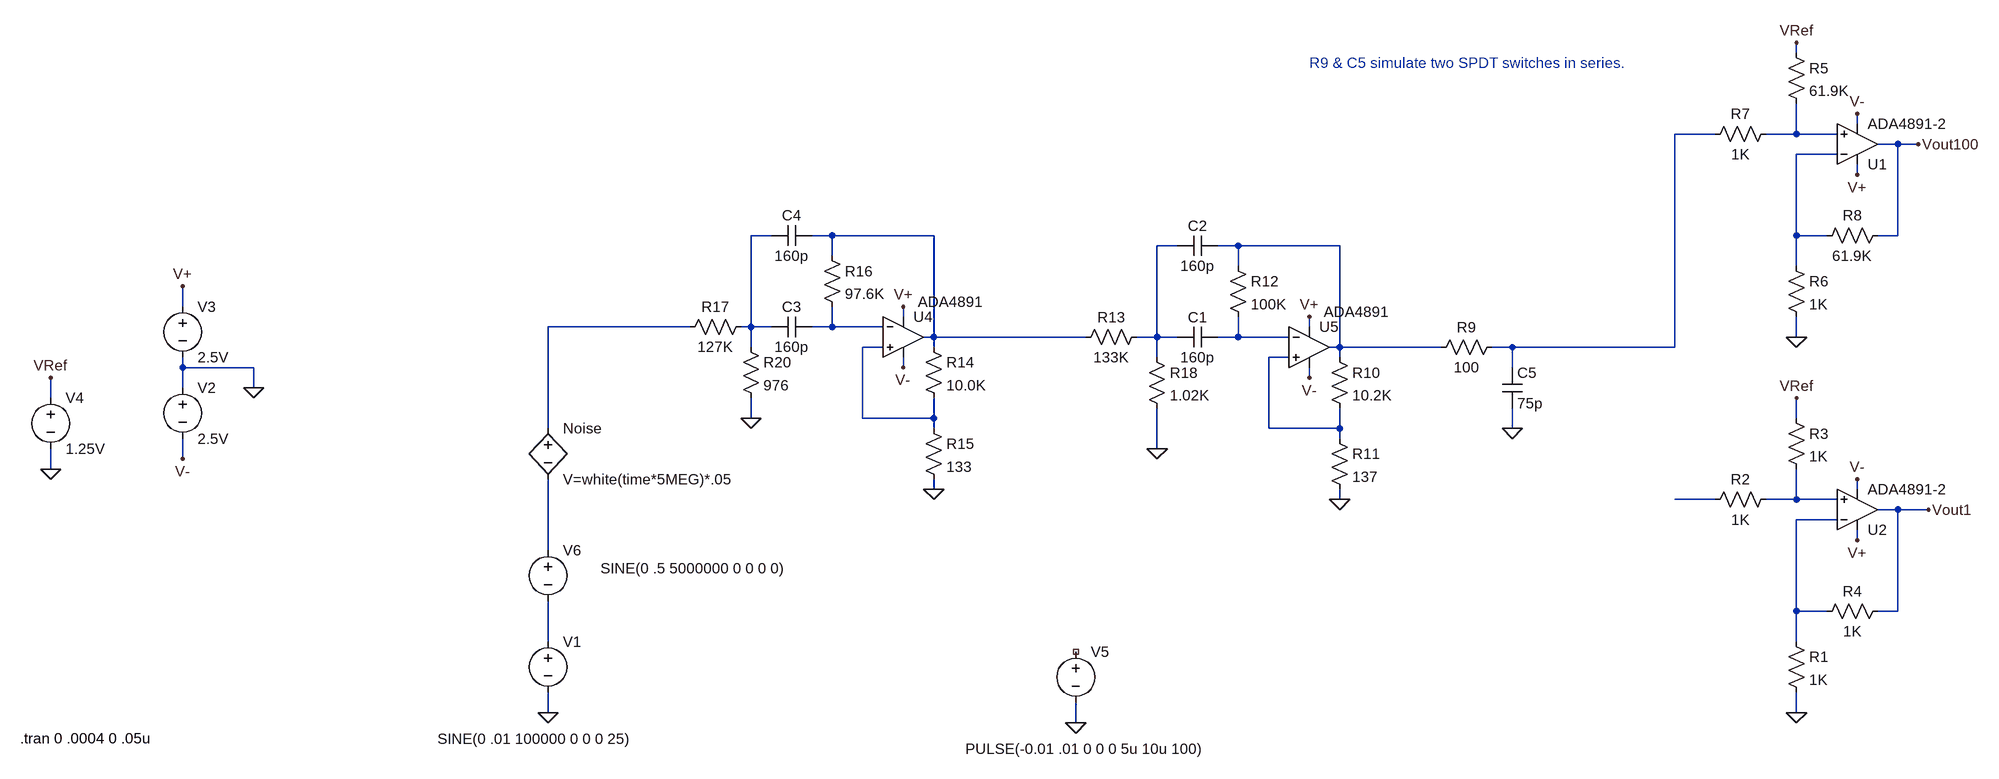
[diagram p0: schematic Draft1.asc]
Draft1.asc, the LTspice schematic file:
Version 4
SHEET 1 1764 792
WIRE 1456 -320 1456 -336
WIRE 1552 -208 1552 -224
WIRE 1328 -192 1264 -192
WIRE 1456 -192 1456 -240
WIRE 1456 -192 1408 -192
WIRE 1520 -192 1456 -192
WIRE 1616 -176 1584 -176
WIRE 1648 -176 1616 -176
WIRE 1520 -160 1456 -160
WIRE 1552 -128 1552 -144
WIRE -160 -32 -192 -32
WIRE -64 -32 -96 -32
WIRE 96 -32 -64 -32
WIRE 1456 -32 1456 -160
WIRE 1504 -32 1456 -32
WIRE 1616 -32 1616 -176
WIRE 1616 -32 1584 -32
WIRE 480 -16 448 -16
WIRE 576 -16 544 -16
WIRE 736 -16 576 -16
WIRE -64 0 -64 -32
WIRE 576 16 576 -16
WIRE 1456 16 1456 -32
WIRE -1088 80 -1088 48
WIRE 48 96 48 80
WIRE -288 112 -512 112
WIRE -192 112 -192 -32
WIRE -192 112 -208 112
WIRE -160 112 -192 112
WIRE -64 112 -64 80
WIRE -64 112 -96 112
WIRE 16 112 -64 112
WIRE 688 112 688 96
WIRE 96 128 96 -32
WIRE 96 128 80 128
WIRE 336 128 96 128
WIRE 448 128 448 -16
WIRE 448 128 416 128
WIRE 480 128 448 128
WIRE 576 128 576 96
WIRE 576 128 544 128
WIRE 656 128 576 128
WIRE 1456 128 1456 96
WIRE -192 144 -192 112
WIRE 16 144 -16 144
WIRE 96 144 96 128
WIRE 736 144 736 -16
WIRE 736 144 720 144
WIRE 896 144 736 144
WIRE 1008 144 976 144
WIRE 1264 144 1264 -192
WIRE 1264 144 1008 144
WIRE 448 160 448 128
WIRE 656 160 624 160
WIRE 736 160 736 144
WIRE -1088 176 -1088 160
WIRE -976 176 -1088 176
WIRE 48 176 48 160
WIRE 1008 176 1008 144
WIRE 688 192 688 176
WIRE -1088 208 -1088 176
WIRE -976 208 -976 176
WIRE -1296 224 -1296 192
WIRE -192 256 -192 224
WIRE -16 256 -16 144
WIRE 96 256 96 224
WIRE 96 256 -16 256
WIRE 1456 256 1456 224
WIRE -512 272 -512 112
WIRE 96 272 96 256
WIRE 624 272 624 160
WIRE 736 272 736 240
WIRE 736 272 624 272
WIRE 1008 272 1008 240
WIRE 736 288 736 272
WIRE 448 304 448 240
WIRE -1088 320 -1088 288
WIRE -1296 336 -1296 304
WIRE 96 368 96 352
WIRE 1552 368 1552 352
WIRE 736 384 736 368
WIRE 1328 384 1264 384
WIRE 1456 384 1456 336
WIRE 1456 384 1408 384
WIRE 1520 384 1456 384
WIRE 1616 400 1584 400
WIRE 1664 400 1616 400
WIRE 1520 416 1456 416
WIRE 1552 448 1552 432
WIRE -512 464 -512 352
WIRE 1456 560 1456 416
WIRE 1504 560 1456 560
WIRE 1616 560 1616 400
WIRE 1616 560 1584 560
WIRE -512 608 -512 544
WIRE 1456 608 1456 560
WIRE -512 720 -512 688
WIRE 1456 720 1456 688
WIRE 320 736 320 704
FLAG -512 720 0
FLAG -976 208 0
FLAG -1088 320 V-
FLAG 1552 448 V+
FLAG 1552 352 V-
FLAG 1456 720 0
FLAG -1296 336 0
FLAG -1088 48 V+
FLAG -1296 192 VRef
FLAG 1456 224 VRef
FLAG 1552 -128 V+
FLAG 1552 -224 V-
FLAG 1456 -336 VRef
FLAG 1456 128 0
FLAG 1648 -176 Vout100
FLAG 1664 400 Vout1
FLAG 688 192 V-
FLAG 688 96 V+
FLAG 736 384 0
FLAG 48 176 V-
FLAG 48 80 V+
FLAG 96 368 0
FLAG 320 736 0
FLAG 448 304 0
FLAG -192 256 0
FLAG 1008 272 0
SYMBOL OpAmps\\ADA4891-2 1552 -112 M180
SYMATTR InstName U1
SYMBOL OpAmps\\ADA4891-2 1552 464 M180
SYMATTR InstName U2
SYMBOL voltage -512 592 R0
WINDOW 3 -174 169 Left 2
WINDOW 123 0 0 Left 0
WINDOW 39 0 0 Left 0
SYMATTR Value SINE(0 .01 100000 0 0 0 25)
SYMATTR InstName V1
SYMBOL voltage -1088 192 R0
WINDOW 123 0 0 Left 0
WINDOW 39 24 124 Left 2
SYMATTR InstName V2
SYMATTR Value 2.5V
SYMBOL res 1440 592 R0
SYMATTR InstName R1
SYMATTR Value 1K
SYMATTR SpiceLine tol=1 pwr=0.1
SYMBOL res 1424 368 R90
WINDOW 0 0 56 VBottom 2
WINDOW 3 32 56 VTop 2
SYMATTR InstName R2
SYMATTR Value 1K
SYMATTR SpiceLine tol=1 pwr=0.1
SYMBOL res 1440 240 R0
SYMATTR InstName R3
SYMATTR Value 1K
SYMATTR SpiceLine tol=1 pwr=0.1
SYMBOL res 1600 544 R90
WINDOW 0 0 56 VBottom 2
WINDOW 3 32 56 VTop 2
SYMATTR InstName R4
SYMATTR Value 1K
SYMATTR SpiceLine tol=1 pwr=0.1
SYMBOL voltage -1296 208 R0
WINDOW 123 0 0 Left 0
WINDOW 39 0 0 Left 0
SYMATTR InstName V4
SYMATTR Value 1.25V
SYMBOL voltage -1088 64 R0
WINDOW 123 0 0 Left 0
WINDOW 39 24 124 Left 2
SYMATTR InstName V3
SYMATTR Value 2.5V
SYMBOL res 1440 -336 R0
SYMATTR InstName R5
SYMATTR Value 61.9K
SYMATTR SpiceLine tol=1 pwr=0.1
SYMBOL res 1440 0 R0
SYMATTR InstName R6
SYMATTR Value 1K
SYMATTR SpiceLine tol=1 pwr=0.1
SYMBOL res 1424 -208 R90
WINDOW 0 0 56 VBottom 2
WINDOW 3 32 56 VTop 2
SYMATTR InstName R7
SYMATTR Value 1K
SYMATTR SpiceLine tol=1 pwr=0.1
SYMBOL res 1600 -48 R90
WINDOW 0 0 56 VBottom 2
WINDOW 3 32 56 VTop 2
SYMATTR InstName R8
SYMATTR Value 61.9K
SYMATTR SpiceLine tol=1 pwr=0.1
SYMBOL res 992 128 R90
WINDOW 0 0 56 VBottom 2
WINDOW 3 32 56 VTop 2
SYMATTR InstName R9
SYMATTR Value 100
SYMATTR SpiceLine tol=1 pwr=0.1
SYMBOL OpAmps\\ADA4891 688 80 R0
WINDOW 3 23 8 Left 2
SYMATTR InstName U5
SYMBOL res 720 144 R0
SYMATTR InstName R10
SYMATTR Value 10.2K
SYMBOL res 720 272 R0
SYMATTR InstName R11
SYMATTR Value 137
SYMBOL res 560 0 R0
SYMATTR InstName R12
SYMATTR Value 100K
SYMBOL res 320 144 R270
WINDOW 0 32 56 VTop 2
WINDOW 3 0 56 VBottom 2
SYMATTR InstName R13
SYMATTR Value 133K
SYMBOL cap 544 112 R90
WINDOW 0 0 32 VBottom 2
WINDOW 3 32 32 VTop 2
SYMATTR InstName C1
SYMATTR Value 160p
SYMBOL cap 544 -32 R90
WINDOW 0 0 32 VBottom 2
WINDOW 3 32 32 VTop 2
SYMATTR InstName C2
SYMATTR Value 160p
SYMBOL OpAmps\\ADA4891 48 64 R0
WINDOW 3 23 8 Left 2
SYMATTR InstName U4
SYMBOL res 80 128 R0
SYMATTR InstName R14
SYMATTR Value 10.0K
SYMBOL res 80 256 R0
SYMATTR InstName R15
SYMATTR Value 133
SYMBOL res -80 -16 R0
SYMATTR InstName R16
SYMATTR Value 97.6K
SYMBOL res -304 128 R270
WINDOW 0 32 56 VTop 2
WINDOW 3 0 56 VBottom 2
SYMATTR InstName R17
SYMATTR Value 127K
SYMBOL cap -96 96 R90
WINDOW 0 0 32 VBottom 2
WINDOW 3 32 32 VTop 2
SYMATTR InstName C3
SYMATTR Value 160p
SYMBOL cap -96 -48 R90
WINDOW 0 0 32 VBottom 2
WINDOW 3 32 32 VTop 2
SYMATTR InstName C4
SYMATTR Value 160p
SYMBOL voltage 320 608 R0
WINDOW 3 -174 169 Left 2
WINDOW 123 0 0 Left 0
WINDOW 39 0 0 Left 0
SYMATTR Value PULSE(-0.01 .01 0 0 0 5u 10u 100)
SYMATTR InstName V5
SYMBOL res 432 144 R0
SYMATTR InstName R18
SYMATTR Value 1.02K
SYMBOL res -208 128 R0
SYMATTR InstName R20
SYMATTR Value 976
SYMBOL cap 992 176 R0
SYMATTR InstName C5
SYMATTR Value 75p
SYMBOL bv -512 256 R0
SYMATTR InstName Noise
SYMATTR Value V=white(time*5MEG)*.05
SYMBOL voltage -512 448 R0
WINDOW 3 83 44 Left 2
WINDOW 123 0 0 Left 0
WINDOW 39 0 0 Left 0
SYMATTR Value SINE(0 .5 5000000 0 0 0 0)
SYMATTR InstName V6
TEXT -1344 760 Left 2 !.tran 0 .0004 0 .05u
TEXT 688 -304 Left 2 ;R9 & C5 simulate two SPDT switches in series.

The netlist it stands for:
* Draft1.asc
XU1 N002 N003 V+ V- Vout100 ADA4891-2  ; pins In+ In- V+ V- OUT
XU2 N014 N015 V+ V- Vout1 ADA4891-2  ; pins In+ In- V+ V- OUT
V1 N017 0 SINE(0 .01 100000 0 0 0 25)
V2 0 V- 2.5V
R1 N015 0 1K tol=1 pwr=0.1
R2 N014 N013 1K tol=1 pwr=0.1
R3 VRef N014 1K tol=1 pwr=0.1
R4 Vout1 N015 1K tol=1 pwr=0.1
V4 VRef 0 1.25V
V3 V+ 0 2.5V
R5 VRef N002 61.9K tol=1 pwr=0.1
R6 N003 0 1K tol=1 pwr=0.1
R7 N002 N001 1K tol=1 pwr=0.1
R8 Vout100 N003 61.9K tol=1 pwr=0.1
R9 N001 N007 100 tol=1 pwr=0.1
XU5 N012 N010 V+ V- N007 ADA4891-1  ; pins In+ In- V+ V- OUT
R10 N007 N012 10.2K
R11 N012 0 137
R12 N007 N010 100K
R13 N005 N006 133K
C1 N010 N006 160p
C2 N007 N006 160p
XU4 N011 N009 V+ V- N005 ADA4891-1  ; pins In+ In- V+ V- OUT
R14 N005 N011 10.0K
R15 N011 0 133
R16 N005 N009 97.6K
R17 N008 N004 127K
C3 N009 N004 160p
C4 N005 N004 160p
V5 NC_01 0 PULSE(-0.01 .01 0 0 0 5u 10u 100)
R18 N006 0 1.02K
R20 N004 0 976
C5 N001 0 75p
B§Noise N008 N016 V=white(time*5MEG)*.05
V6 N016 N017 SINE(0 .5 5000000 0 0 0 0)
.tran 0 .0004 0 .05u
* R9 & C5 simulate two SPDT switches in series.
.lib ADA4891-1.lib
.backanno
.end